# EAGLE schematic V2_XB24DM_node_doublelayer (EAGLE 7.2.0)
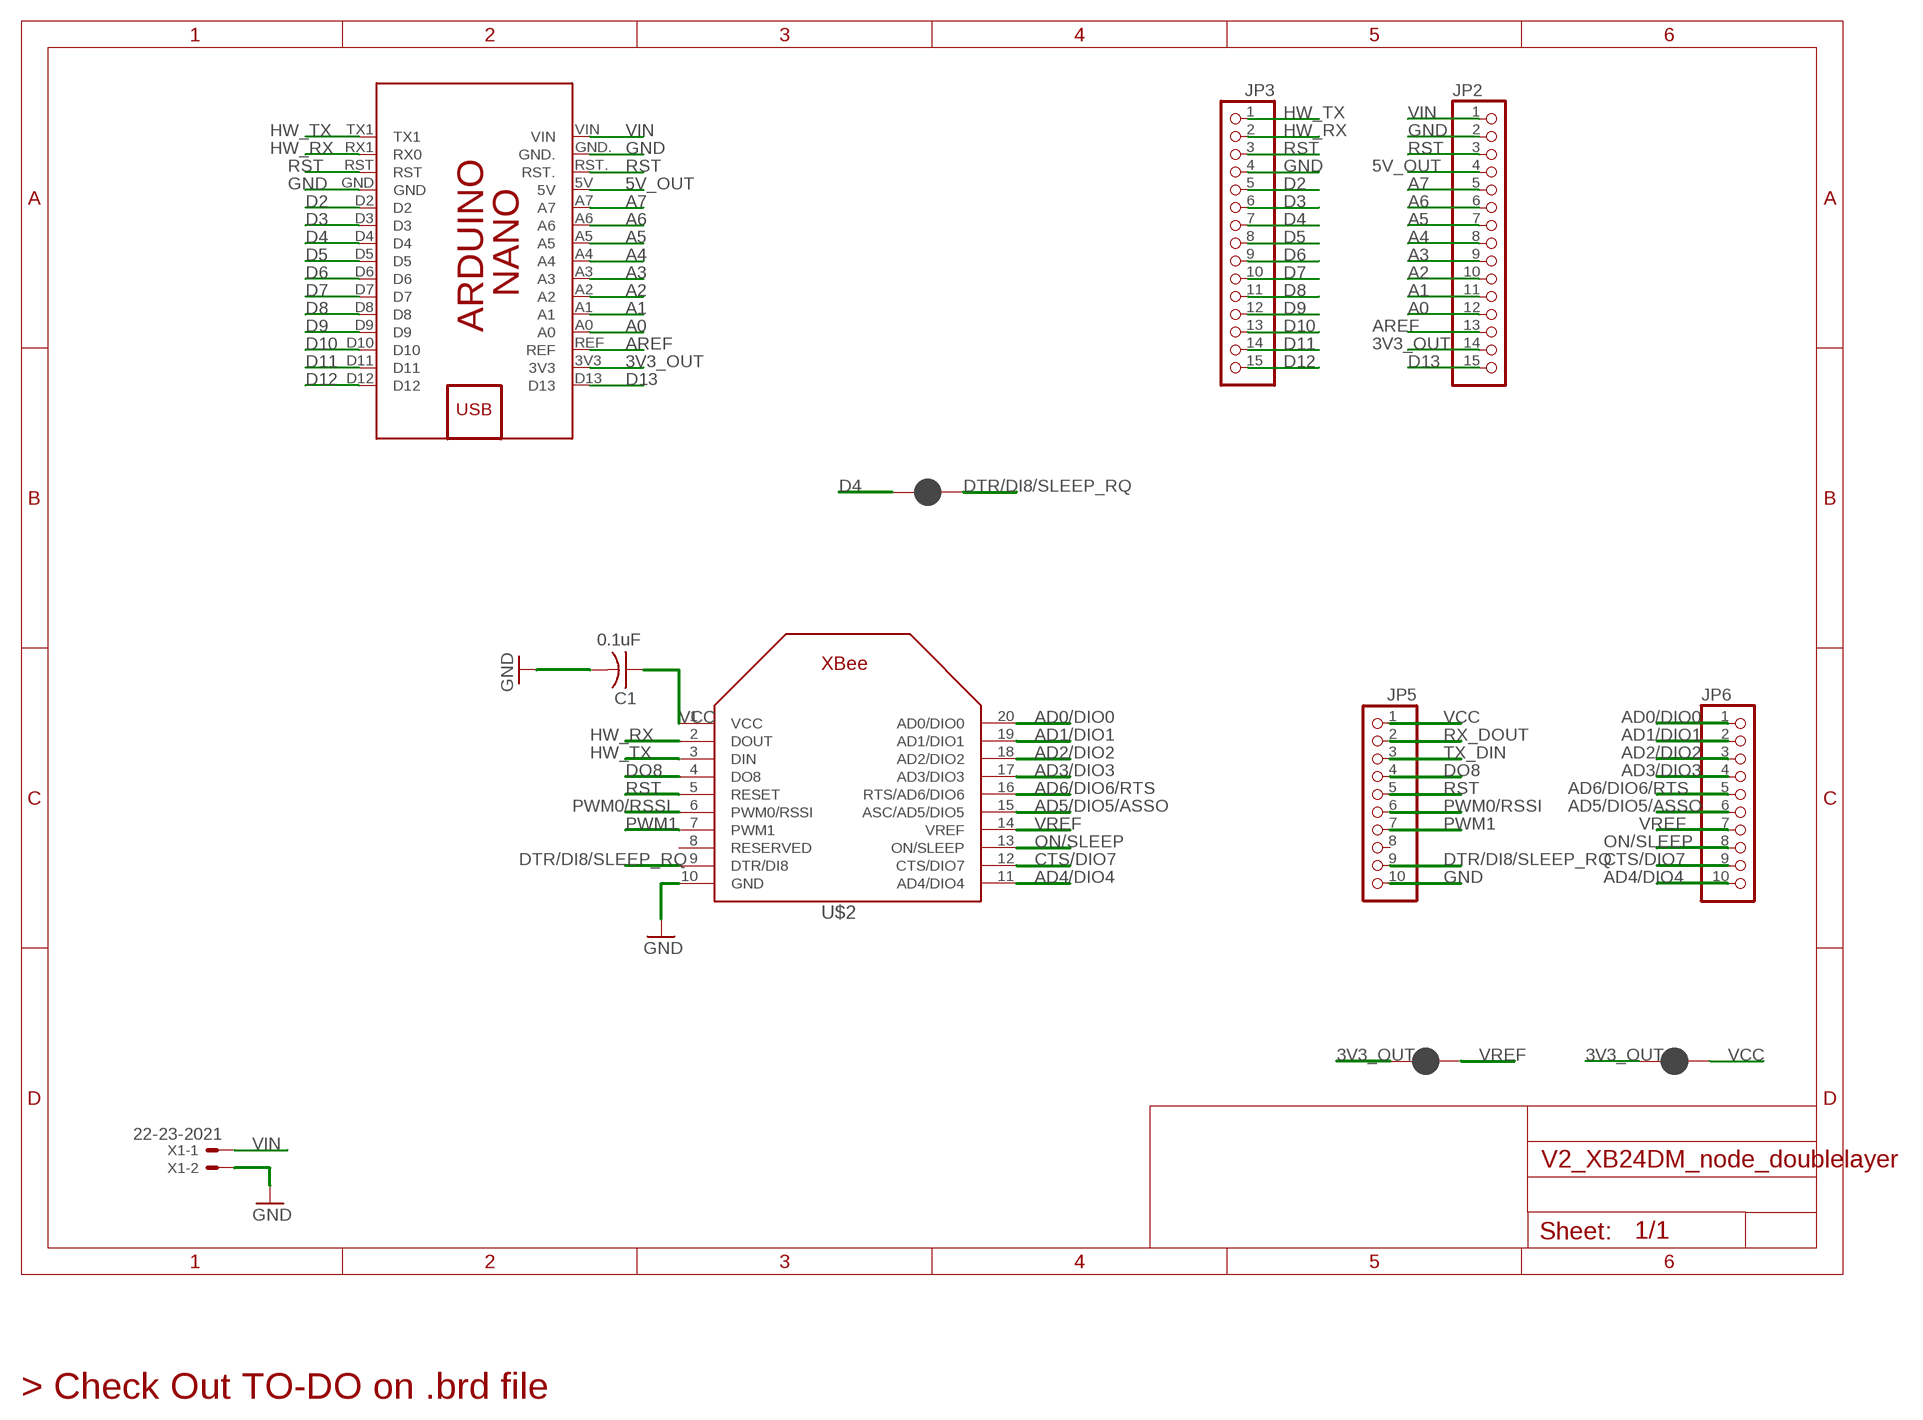
[diagram p0: schematic, sheet 1]

## Parts
C1  0.1uF  C-USC1206  [C1206]
JP1  JUMPER-PAD-2-NC_BY_PASTEFULL-BOX-SILK  [PAD-JUMPER-2-NC_BY_PASTE_YES_SILK_FULL_BOX]
JP2  PINHD-1X15  [1X15]
JP3  PINHD-1X15  [1X15]
JP4  JUMPER-PAD-2-NC_BY_PASTEFULL-BOX-SILK  [PAD-JUMPER-2-NC_BY_PASTE_YES_SILK_FULL_BOX]
JP5  PINHD-1X10  [1X10]
JP6  PINHD-1X10  [1X10]
JP7  JUMPER-PAD-2-NC_BY_PASTEFULL-BOX-SILK  [PAD-JUMPER-2-NC_BY_PASTE_YES_SILK_FULL_BOX]
PCB1  ARDUINO_NANO  [ARDUINO_NANO]
U$2  XBEE  [XBEE]
X1  22-23-2021  [22-23-2021]

## Nets
3V3_OUT: JP1.1 JP2.14 JP7.1 PCB1.3V3
5V_OUT: JP2.4 PCB1.5V
A0: JP2.12 PCB1.A0
A1: JP2.11 PCB1.A1
A2: JP2.10 PCB1.A2
A3: JP2.9 PCB1.A3
A4: JP2.8 PCB1.A4
A5: JP2.7 PCB1.A5
A6: JP2.6 PCB1.A6
A7: JP2.5 PCB1.A7
AD0/DIO0: JP6.1 U$2.20(AD0/DIO0)
AD1/DIO1: JP6.2 U$2.19(AD1/DIO1)
AD2/DIO2: JP6.3 U$2.18(AD2/DIO2)
AD3/DIO3: JP6.4 U$2.17(AD3/DIO3)
AD4/DIO4: JP6.10 U$2.11(AD4/DIO4)
AD5/DIO5/ASSO: JP6.6 U$2.15(ASC/AD5/DIO5)
AD6/DIO6/RTS: JP6.5 U$2.16(RTS/AD6/DIO6)
AREF: JP2.13 PCB1.REF
CTS/DIO7: JP6.9 U$2.12(CTS/DIO7)
D2: JP3.5 PCB1.D2
D3: JP3.6 PCB1.D3
D4: JP3.7 JP4.1 PCB1.D4
D5: JP3.8 PCB1.D5
D6: JP3.9 PCB1.D6
D7: JP3.10 PCB1.D7
D8: JP3.11 PCB1.D8
D9: JP3.12 PCB1.D9
D10: JP3.13 PCB1.D10
D11: JP3.14 PCB1.D11
D12: JP3.15 PCB1.D12
D13: JP2.15 PCB1.D13
DO8: JP5.4 U$2.4(DO8)
DTR/DI8/SLEEP_RQ: JP4.2 JP5.9 U$2.9(DTR/DI8)
GND: C1.2 JP2.2 JP3.4 JP5.10 PCB1.GND PCB1.GND. U$2.10(GND) X1.2
HW_RX: JP3.2 PCB1.RX1(RX0) U$2.2(DOUT)
HW_TX: JP3.1 PCB1.TX1 U$2.3(DIN)
ON/SLEEP: JP6.8 U$2.13(ON/SLEEP)
PWM0/RSSI: JP5.6 U$2.6(PWM0/RSSI)
PWM1: JP5.7 U$2.7(PWM1)
RST: JP2.3 JP3.3 JP5.5 PCB1.RST PCB1.RST. U$2.5(RESET)
RX_DOUT: JP5.2
TX_DIN: JP5.3
VCC: C1.1 JP1.2 JP5.1 U$2.1(VCC)
VIN: JP2.1 PCB1.VIN X1.1
VREF: JP6.7 JP7.2 U$2.14(VREF)
Unconnected: JP5.8 U$2.8(RESERVED)

## Notes on the sheet
- > Check Out TO-DO on .brd file

## Library data of the parts
C1 = rcl:C-US: CAPACITOR, American symbol
JP1 JP4 JP7 = SparkFun-Passives:JUMPER-PAD-2-NC_BY_PASTE
JP2 JP3 = pinhead:PINHD-1X15: PIN HEADER
JP5 JP6 = pinhead:PINHD-1X10: PIN HEADER
PCB1 = wavzlab:ARDUINO_NANO: Arduino Nano V3 board with a footprint in an EAGLE design. Created by Dave Young for Element14. Modified by AMAR P, Wavz Lab.
U$2 = adafruit:XBEE
X1 = con-molex:22-23-2021: .100" (2.54mm) Center Header - 2 Pin; MF: MOLEX; MPN: 22-23-2021; OC_FARNELL: 1462926; OC_NEWARK: 25C3832

## Net classes
0 default: width 0.457 mm, clearance 0.254 mm
1 pwr: width 0.61 mm, drill 0.508 mm, clearance 0.254 mm
2 gnd: width 0.61 mm, drill 0.508 mm, clearance 0.254 mm